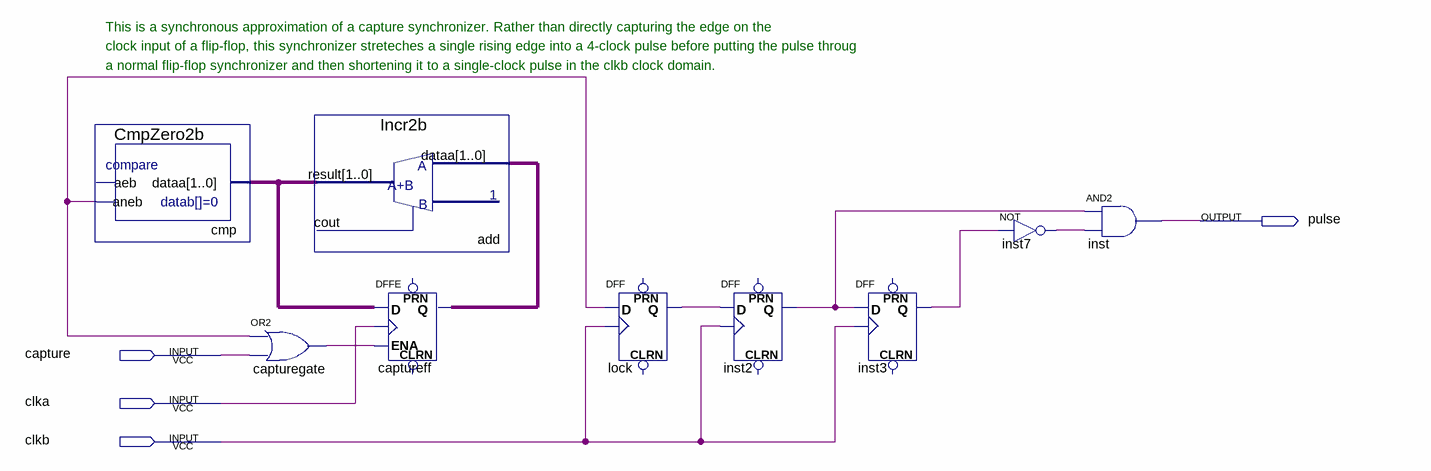
[diagram p0: schematic sheet]
// Quartus schematic CaptureSynchronizer.bdf as structural Verilog: 9 symbols, 4 pins
module CaptureSynchronizer (
  input  capture,
  input  clka,
  input  clkb,
  output pulse
);

  wire capturegate_out, cmp_aneb, inst2_q, inst3_q, inst7_out, lock_q;
  wire [1:0] add_result, captureff_q;

  CmpZero2b cmp (.dataa(add_result), .aneb(cmp_aneb));  // open: aeb
  or capturegate (capturegate_out, cmp_aneb, capture);
  Incr2b add (.dataa(captureff_q), .result(add_result));  // open: cout
  DFFE captureff[1:0] (.D(add_result), .CLK(clka), .ENA(capturegate_out), .Q(captureff_q));  // open: PRN, CLRN
  DFF lock (.CLK(clkb), .D(cmp_aneb), .Q(lock_q));  // open: CLRN, PRN
  DFF inst2 (.CLK(clkb), .D(lock_q), .Q(inst2_q));  // open: CLRN, PRN
  DFF inst3 (.CLK(clkb), .D(inst2_q), .Q(inst3_q));  // open: CLRN, PRN
  not inst7 (inst7_out, inst3_q);
  and inst (pulse, inst2_q, inst7_out);

  // Notes on the sheet:
  //   This is a synchronous approximation of a capture synchronizer. Rather than directly capturing the edge on the
  //   clock input of a flip-flop, this synchronizer streteches a single rising edge into a 4-clock pulse before putting the pulse throug
  //   a normal flip-flop synchronizer and then shortening it to a single-clock pulse in the clkb clock domain.
endmodule
